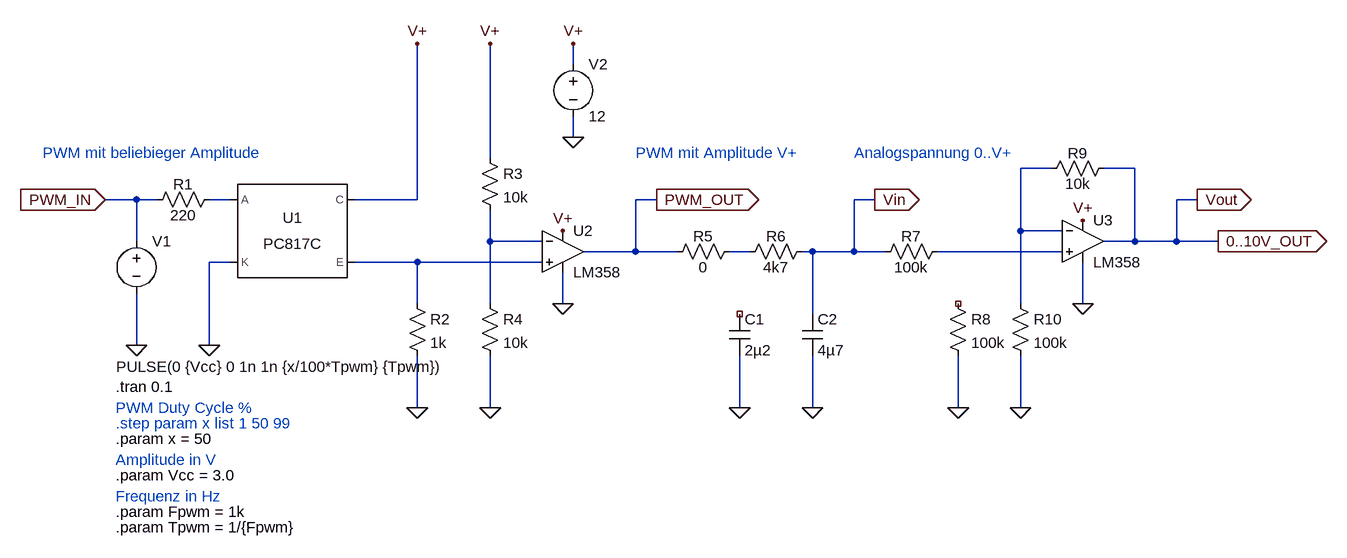
[diagram p0: schematic Draft2 PWM mit OpAmp.asc]
Draft2 PWM mit OpAmp.asc, the LTspice schematic file:
Version 4
SHEET 1 1196 680
WIRE -240 -64 -240 -96
WIRE -240 48 -240 16
WIRE -368 80 -368 -96
WIRE 496 96 448 96
WIRE 624 96 576 96
WIRE -912 144 -960 144
WIRE -880 144 -912 144
WIRE -768 144 -800 144
WIRE -480 144 -480 -96
WIRE -480 144 -576 144
WIRE -112 144 -144 144
WIRE 224 144 192 144
WIRE 720 144 688 144
WIRE 448 192 448 96
WIRE 512 192 448 192
WIRE -912 208 -912 144
WIRE -368 208 -368 160
WIRE -288 208 -368 208
WIRE 624 208 624 96
WIRE 624 208 576 208
WIRE 688 208 688 144
WIRE 688 208 624 208
WIRE 752 208 688 208
WIRE -144 224 -144 144
WIRE -144 224 -224 224
WIRE -80 224 -144 224
WIRE 32 224 0 224
WIRE 128 224 112 224
WIRE 192 224 192 144
WIRE 192 224 128 224
WIRE 240 224 192 224
WIRE 512 224 320 224
WIRE -768 240 -800 240
WIRE -480 240 -576 240
WIRE -288 240 -480 240
WIRE -480 304 -480 240
WIRE -368 304 -368 208
WIRE -256 304 -256 256
WIRE 448 304 448 192
WIRE 544 304 544 240
WIRE 128 320 128 224
WIRE -912 368 -912 288
WIRE -800 368 -800 240
WIRE -480 464 -480 384
WIRE -368 464 -368 384
WIRE 16 464 16 384
WIRE 128 464 128 384
WIRE 352 464 352 384
WIRE 448 464 448 384
FLAG -912 368 0
FLAG -240 48 0
FLAG 352 464 0
FLAG 752 208 0..10V_OUT
IOPIN 752 208 Out
FLAG 128 464 0
FLAG 16 464 0
FLAG -256 192 V+
FLAG -240 -96 V+
FLAG 544 176 V+
FLAG -960 144 PWM_IN
IOPIN -960 144 In
FLAG -800 368 0
FLAG -368 464 0
FLAG -368 -96 V+
FLAG -480 464 0
FLAG -480 -96 V+
FLAG -112 144 PWM_OUT
IOPIN -112 144 Out
FLAG 448 464 0
FLAG 224 144 Vin
IOPIN 224 144 Out
FLAG 720 144 Vout
IOPIN 720 144 Out
FLAG -256 304 0
FLAG 544 304 0
SYMBOL voltage -912 192 R0
WINDOW 123 0 0 Left 0
WINDOW 39 0 0 Left 0
WINDOW 3 -31 209 Left 2
SYMATTR Value PULSE(0 {Vcc} 0 1n 1n {x/100*Tpwm} {Tpwm})
SYMATTR InstName V1
SYMBOL voltage -240 -80 R0
WINDOW 123 0 0 Left 0
WINDOW 39 0 0 Left 0
SYMATTR InstName V2
SYMATTR Value 12
SYMBOL res 16 208 R90
WINDOW 0 8 56 VBottom 2
WINDOW 3 24 56 VTop 2
SYMATTR InstName R5
SYMATTR Value 0
SYMBOL cap 112 320 R0
SYMATTR InstName C2
SYMATTR Value 4µ7
SYMBOL res 336 208 R90
WINDOW 0 8 56 VBottom 2
WINDOW 3 24 56 VTop 2
SYMATTR InstName R7
SYMATTR Value 100k
SYMBOL res 336 288 R0
SYMATTR InstName R8
SYMATTR Value 100k
SYMBOL OpAmps\\LM358 544 144 R0
SYMATTR InstName U3
SYMBOL cap 0 320 R0
SYMATTR InstName C1
SYMATTR Value 2µ2
SYMBOL res 128 208 R90
WINDOW 0 8 56 VBottom 2
WINDOW 3 24 56 VTop 2
SYMATTR InstName R6
SYMATTR Value 4k7
SYMBOL OpAmps\\LM358 -256 160 R0
SYMATTR InstName U2
SYMBOL res -784 128 R90
WINDOW 0 8 56 VBottom 2
WINDOW 3 24 56 VTop 2
SYMATTR InstName R1
SYMATTR Value 220
SYMBOL Optos\\PC817C -672 192 R0
SYMATTR InstName U1
SYMBOL res -384 64 R0
SYMATTR InstName R3
SYMATTR Value 10k
SYMBOL res -384 288 R0
SYMATTR InstName R4
SYMATTR Value 10k
SYMBOL res -496 288 R0
SYMATTR InstName R2
SYMATTR Value 1k
SYMBOL res 432 288 R0
SYMATTR InstName R10
SYMATTR Value 100k
SYMBOL res 592 80 R90
WINDOW 0 8 56 VBottom 2
WINDOW 3 24 56 VTop 2
SYMATTR InstName R9
SYMATTR Value 10k
TEXT -944 432 Left 2 !.tran 0.1
TEXT -944 488 Left 2 ;.step param x list 1 50 99
TEXT -944 464 Left 2 ;PWM Duty Cycle %
TEXT -944 568 Left 2 !.param Vcc = 3.0
TEXT -944 648 Left 2 !.param Tpwm = 1/{Fpwm}
TEXT -944 624 Left 2 !.param Fpwm = 1k
TEXT -944 600 Left 2 ;Frequenz in Hz
TEXT -944 544 Left 2 ;Amplitude in V
TEXT -944 512 Left 2 !.param x = 50
TEXT -1056 72 Left 2 ;PWM mit beliebieger Amplitude
TEXT -144 72 Left 2 ;PWM mit Amplitude V+
TEXT 192 72 Left 2 ;Analogspannung 0..V+

The netlist it stands for:
* Draft2 PWM mit OpAmp.asc
V1 PWM_IN 0 PULSE(0 {Vcc} 0 1n 1n {x/100*Tpwm} {Tpwm})
V2 V+ 0 12
R5 N004 PWM_OUT 0
C2 Vin 0 4µ7
R7 N005 Vin 100k
R8 NC_01 0 100k
XU3 N005 N001 V+ 0 Vout LM358  ; pins In+ In- V+ V- OUT
C1 NC_02 0 2µ2
R6 Vin N004 4k7
XU2 N006 N003 V+ 0 PWM_OUT LM358  ; pins In+ In- V+ V- OUT
R1 N002 PWM_IN 220
XU1 N002 0 V+ N006 PC817 Igain=2.3m  ; PC817C, pins A K C E
R3 V+ N003 10k
R4 N003 0 10k
R2 N006 0 1k
R10 N001 0 100k
R9 Vout N001 10k
.tran 0.1
* .step param x list 1 50 99
* PWM Duty Cycle %
.param Vcc = 3.0
.param Tpwm = 1/{Fpwm}
.param Fpwm = 1k
* Frequenz in Hz
* Amplitude in V
.param x = 50
* PWM mit beliebieger Amplitude
* PWM mit Amplitude V+
* Analogspannung 0..V+
.lib PC817.sub
.backanno
.end